# Altium schematic sheet TDisplay.SchDoc: LiveDesign Evaluation - Serial
size A4; Organization: Altium Limited; Address1: L3, 12a Rodborough Rd; Address2: Frenchs Forest; Address3: NSW; Address4: Australia 2086; DocumentNumber: 6; SheetNumber: 6; SheetTotal: 7
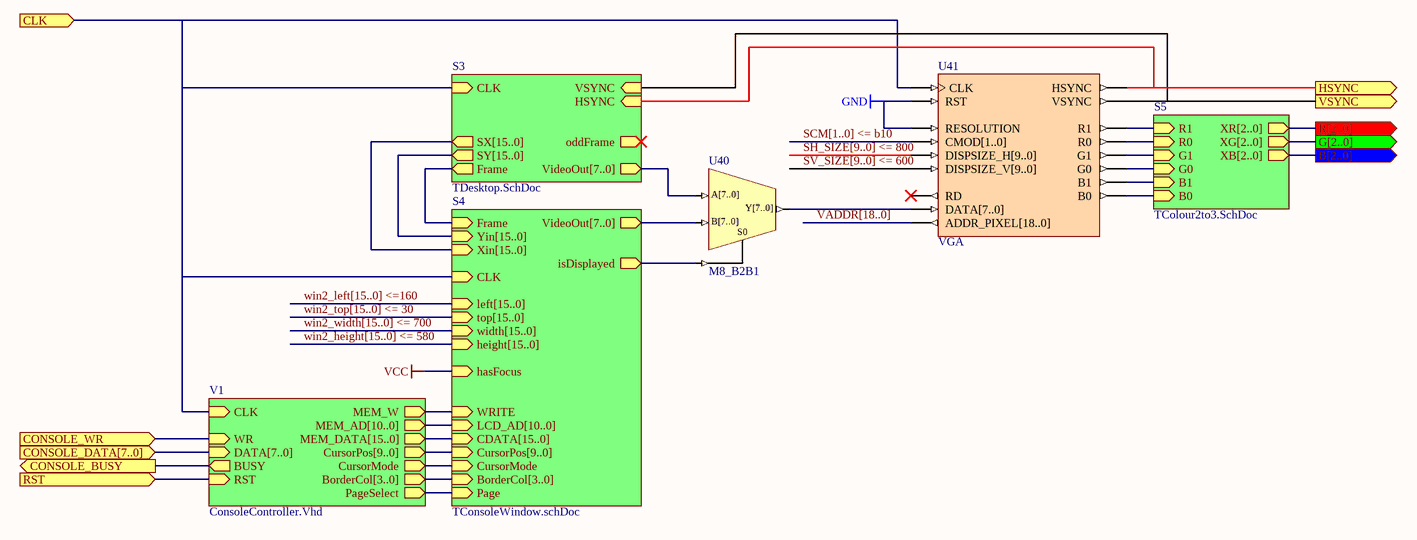
[diagram p0: TDisplay.SchDoc]

## Parts
U40  M8_B2B1
U41  VGA

## Sub-sheets
S3 = TDesktop.SchDoc: CLK (in), VideoOut[7..0] (out), SX[15..0] (out), SY[15..0] (out), HSYNC (in), VSYNC (in), Frame (out), oddFrame (out)
S4 = TConsoleWindow.schDoc: CLK (in), VideoOut[7..0] (out), Xin[15..0] (in), Yin[15..0] (in), top[15..0] (in), width[15..0] (in), height[15..0] (in), left[15..0] (in), isDisplayed (out), hasFocus (in), Frame (in), WRITE (in), LCD_AD[10..0] (in), CDATA[15..0] (in), CursorPos[9..0] (in), CursorMode (in), BorderCol[3..0] (in), Page (in)
S5 = TColour2to3.SchDoc: XR[2..0] (out), XG[2..0] (out), XB[2..0] (out), R1 (in), R0 (in), G1 (in), G0 (in), B1 (in), B0 (in)
V1 = ConsoleController.Vhd: WR (in), DATA[7..0] (in), BUSY (out), RST (in), MEM_W (out), MEM_AD[10..0] (out), MEM_DATA[15..0] (out), CLK (in), CursorPos[9..0] (out), CursorMode (out), BorderCol[3..0] (out), PageSelect (out)

## Ports
B[2..0] (out), CLK (in), CONSOLE_BUSY (out), CONSOLE_DATA[7..0] (in), CONSOLE_WR (in), G[2..0] (out), HSYNC (out), R[2..0] (out), RST (in), VSYNC (out)

## Nets
GND: U41.RESOLUTION U41.RST
VCC: sheet S4/hasFocus
CLK: U41.CLK ; port CLK, sheet S3/CLK, sheet S4/CLK, sheet V1/CLK
CONSOLE_BUSY: port CONSOLE_BUSY, sheet V1/BUSY
CONSOLE_WR: port CONSOLE_WR, sheet V1/WR
HSYNC: U41.HSYNC ; port HSYNC, sheet S3/HSYNC
RST: port RST, sheet V1/RST
SCM[1..0] <= b10: U41.CMOD[1..0]
SH_SIZE[9..0] <= 800: U41.DISPSIZE_H[9..0]
SV_SIZE[9..0] <= 600: U41.DISPSIZE_V[9..0]
VADDR[18..0]: U41.ADDR_PIXEL[18..0]
VSYNC: U41.VSYNC ; port VSYNC, sheet S3/VSYNC
NetU40_A[7..0]: U40.A[7..0] ; sheet S3/VideoOut[7..0]
NetU40_B[7..0]: U40.B[7..0] ; sheet S4/VideoOut[7..0]
NetU40_S0: U40.S0 ; sheet S4/isDisplayed
NetU40_Y[7..0]: U40.Y[7..0] U41.DATA[7..0]
NetU41_B0: U41.B0 ; sheet S5/B0
NetU41_B1: U41.B1 ; sheet S5/B1
NetU41_G0: U41.G0 ; sheet S5/G0
NetU41_G1: U41.G1 ; sheet S5/G1
NetU41_R0: U41.R0 ; sheet S5/R0
NetU41_R1: U41.R1 ; sheet S5/R1
(unnamed): sheet S3/Frame, sheet S4/Frame
(unnamed): sheet S4/WRITE, sheet V1/MEM_W
(unnamed): sheet S4/CursorMode, sheet V1/CursorMode
(unnamed): sheet S4/Page, sheet V1/PageSelect

Not connected (* = marked no-connect by the designer): U41 RD*

## Buses and harness runs
bus port B[2..0] = sheet S5/XB[2..0]
bus port CONSOLE_DATA[7..0] = sheet V1/DATA[7..0]
bus port G[2..0] = sheet S5/XG[2..0]
bus port R[2..0] = sheet S5/XR[2..0]
bus SCM[1..0] <= b10
bus SH_SIZE[9..0] <= 800
bus sheet S3/SX[15..0] = sheet S4/Xin[15..0]
bus sheet S3/SY[15..0] = sheet S4/Yin[15..0]
bus sheet S4/BorderCol[3..0] = sheet V1/BorderCol[3..0]
bus sheet S4/CDATA[15..0] = sheet V1/MEM_DATA[15..0]
bus sheet S4/CursorPos[9..0] = sheet V1/CursorPos[9..0]
bus sheet S4/LCD_AD[10..0] = sheet V1/MEM_AD[10..0]
bus SV_SIZE[9..0] <= 600
bus VADDR[18..0]
bus win2_height[15..0] <= 580 = sheet S4/height[15..0]
bus win2_left[15..0] <=160 = sheet S4/left[15..0]
bus win2_top[15..0] <= 30 = sheet S4/top[15..0]
bus win2_width[15..0] <= 700 = sheet S4/width[15..0]

## Notes on the sheet
- Title
- Size:
- Date:
- A4
- Number:
- Time:
- Revision:
- Sheet
- of
- File:

## Library data of the parts
U40 = M8_B2B1: 2x8-Bit Bus to 1x8-Bit Bus Multiplexer; ArchiveName: GENERIC; VHDLIB_SIM: GENERIC_LIB; Published: 29-Jan-2004; Publisher: Altium Limited; Core Revision: 1.00.00
U41 = VGA: VGA Controller; Published: 18/12/2003; Publisher: Altium Hobart Technology Centre; Core Revision: 1.00.00